# Altium schematic sheet dc-breakout-board.SchDoc
size A; SheetNumber: 1; SheetTotal: 1
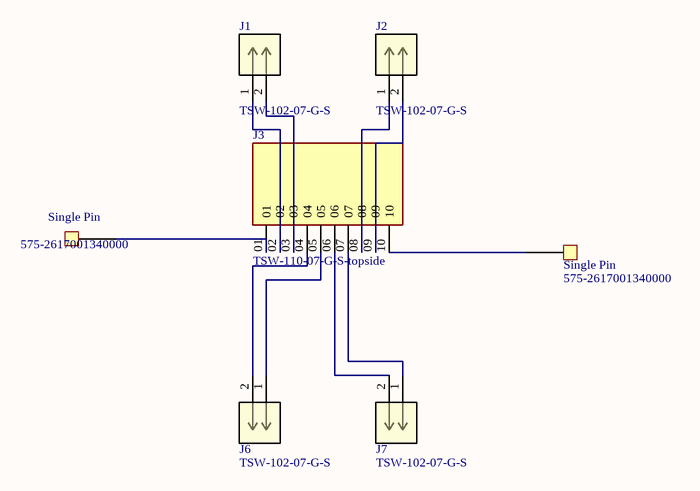
[diagram p0: dc-breakout-board.SchDoc]

## Parts
J1  TSW-102-07-G-S  [TSW-102-07-G-S-iceberg]
J2  TSW-102-07-G-S  [TSW-102-07-G-S-iceberg]
J3  TSW-110-07-G-S-topside  [SAMTEC_TSW-110-07-G-S]
J4  Single Pin  Supplier Part Number 1: 575-2617001340000  [Single PC Pin]
J5  Single Pin  Supplier Part Number 1: 575-2617001340000  [Single PC Pin]
J6  TSW-102-07-G-S  [TSW-102-07-G-S-iceberg]
J7  TSW-102-07-G-S  [TSW-102-07-G-S-iceberg]

## Nets
NetJ1_1: J1.1 J3.02
NetJ1_2: J1.2 J3.03
NetJ2_1: J2.1 J3.08
NetJ2_2: J2.2 J3.09
NetJ3_01: J3.01 J4.1
NetJ3_04: J3.04 J6.2
NetJ3_05: J3.05 J6.1
NetJ3_06: J3.06 J7.2
NetJ3_07: J3.07 J7.1
NetJ3_10: J3.10 J5.1

## Library data of the parts
J1 J2 J6 J7 = TSW-102-07-G-S-iceberg: No Description Available; Mfr_Name: Samtec Inc; Copyright: Copyright (C) 2024 Ultra Librarian. All rights reserved.; Manufacturer_Part_Number: TSW-102-07-G-S; RefDes: RefDes; Type: DEV
J3 = TSW-110-07-G-S-topside: MF: Samtec Inc.; Package: None; Price: None; Value: *; MP: TSW-110-07-G-S; Availability: Unavailable
J4 J5 = Single PC Pin: Supplier 1: Mouser